# Altium schematic sheet CompassIO.SchDoc
size A4; SheetNumber: 0
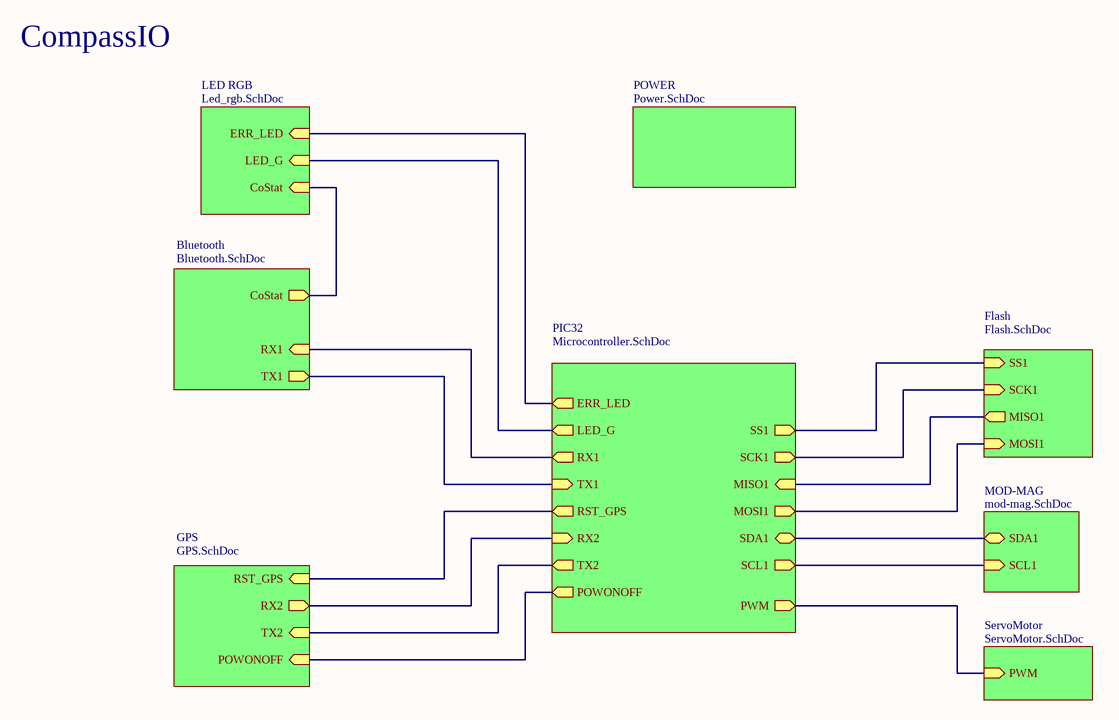
[diagram p0: CompassIO.SchDoc]

## Sub-sheets
Bluetooth = Bluetooth.SchDoc: CoStat (out), RX1 (in), TX1 (out)
Flash = Flash.SchDoc: SS1 (in), SCK1 (in), MISO1 (out), MOSI1 (in)
GPS = GPS.SchDoc: RST_GPS (in), TX2 (in), RX2 (out), POWONOFF (in)
LED RGB = Led_rgb.SchDoc: LED_G (in), CoStat (in), ERR_LED (in)
MOD-MAG = mod-mag.SchDoc: SDA1 (bidir), SCL1 (in)
PIC32 = Microcontroller.SchDoc: POWONOFF (out), RX2 (in), TX2 (out), RST_GPS (out), LED_G (out), RX1 (out), TX1 (in), SS1 (out), SCK1 (out), MISO1 (in), MOSI1 (out), SDA1 (bidir), PWM (out), SCL1 (out), ERR_LED (out)
POWER = Power.SchDoc: no entries
ServoMotor = ServoMotor.SchDoc: PWM (in)

## Nets
(unnamed): sheet Bluetooth/CoStat, sheet LED RGB/CoStat
(unnamed): sheet Bluetooth/RX1, sheet PIC32/RX1
(unnamed): sheet Bluetooth/TX1, sheet PIC32/TX1
(unnamed): sheet PIC32/POWONOFF, sheet GPS/POWONOFF
(unnamed): sheet PIC32/RX2, sheet GPS/RX2
(unnamed): sheet PIC32/TX2, sheet GPS/TX2
(unnamed): sheet PIC32/RST_GPS, sheet GPS/RST_GPS
(unnamed): sheet PIC32/LED_G, sheet LED RGB/LED_G
(unnamed): sheet PIC32/SS1, sheet Flash/SS1
(unnamed): sheet PIC32/SCK1, sheet Flash/SCK1
(unnamed): sheet PIC32/MISO1, sheet Flash/MISO1
(unnamed): sheet PIC32/MOSI1, sheet Flash/MOSI1
(unnamed): sheet PIC32/SDA1, sheet MOD-MAG/SDA1
(unnamed): sheet PIC32/PWM, sheet ServoMotor/PWM
(unnamed): sheet PIC32/SCL1, sheet MOD-MAG/SCL1
(unnamed): sheet PIC32/ERR_LED, sheet LED RGB/ERR_LED

## Notes on the sheet
- CompassIO